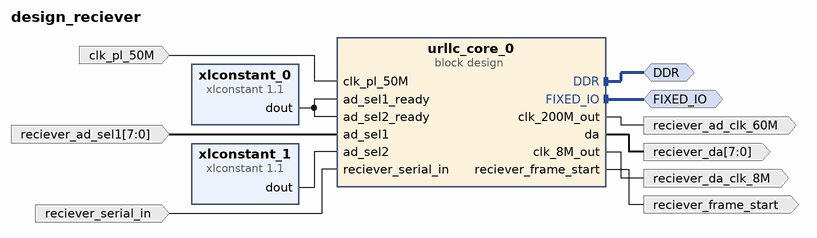
[diagram p0: block diagram of the top level]
# Vivado block design design_reciever, xc7z020clg400-2, Vivado 2021.1
create_bd_design design_reciever

create_bd_intf_port -mode Master -vlnv xilinx.com:interface:ddrx_rtl:1.0 DDR
create_bd_intf_port -mode Master -vlnv xilinx.com:display_processing_system7:fixedio_rtl:1.0 FIXED_IO
create_bd_port -dir I -from 7 -to 0 -type data reciever_ad_sel1
create_bd_port -dir O -type clk reciever_ad_clk_60M
set_property -dict {CONFIG.FREQ_HZ 60000000} [get_bd_ports reciever_ad_clk_60M]
create_bd_port -dir O -type clk reciever_da_clk_8M
create_bd_port -dir O -from 7 -to 0 -type data reciever_da
create_bd_port -dir I -type clk clk_pl_50M
set_property -dict {CONFIG.FREQ_HZ 50000000} [get_bd_ports clk_pl_50M]
create_bd_port -dir I -type intr reciever_serial_in
set_property -dict {CONFIG.SENSITIVITY EDGE_RISING} [get_bd_ports reciever_serial_in]
create_bd_port -dir O -type intr reciever_frame_start

create_bd_cell -type container -reference urllc_core urllc_core_0
set_property -dict [list \
  CONFIG.ACTIVE_SIM_BD urllc_core.bd \
  CONFIG.ACTIVE_SYNTH_BD urllc_core.bd \
  CONFIG.ENABLE_DFX 0 \
  CONFIG.LIST_SIM_BD urllc_core.bd \
  CONFIG.LIST_SYNTH_BD urllc_core.bd \
  CONFIG.LOCK_PROPAGATE 0 \
] [get_bd_cells urllc_core_0]
create_bd_cell -type ip -vlnv xilinx.com:ip:xlconstant:1.1 xlconstant_0
set_property -dict {CONFIG.CONST_VAL 0} [get_bd_cells xlconstant_0]
create_bd_cell -type ip -vlnv xilinx.com:ip:xlconstant:1.1 xlconstant_1
set_property -dict {CONFIG.CONST_VAL 0 CONFIG.CONST_WIDTH 8} [get_bd_cells xlconstant_1]

# ---- connections ----

connect_bd_intf_net [get_bd_intf_ports DDR] [get_bd_intf_pins urllc_core_0/DDR]
connect_bd_intf_net [get_bd_intf_ports FIXED_IO] [get_bd_intf_pins urllc_core_0/FIXED_IO]
connect_bd_net [get_bd_ports clk_pl_50M] [get_bd_pins urllc_core_0/clk_pl_50M]
connect_bd_net -net reciever_ad_sel1_1 [get_bd_ports reciever_ad_sel1] [get_bd_pins urllc_core_0/ad_sel1]
connect_bd_net [get_bd_ports reciever_serial_in] [get_bd_pins urllc_core_0/reciever_serial_in]
connect_bd_net [get_bd_pins urllc_core_0/clk_200M_out] [get_bd_ports reciever_ad_clk_60M]
connect_bd_net [get_bd_pins urllc_core_0/clk_8M_out] [get_bd_ports reciever_da_clk_8M]
connect_bd_net [get_bd_pins urllc_core_0/da] [get_bd_ports reciever_da]
connect_bd_net [get_bd_pins urllc_core_0/reciever_frame_start] [get_bd_ports reciever_frame_start]
connect_bd_net [get_bd_pins xlconstant_0/dout] [get_bd_pins urllc_core_0/ad_sel1_ready] [get_bd_pins urllc_core_0/ad_sel2_ready]
connect_bd_net [get_bd_pins xlconstant_1/dout] [get_bd_pins urllc_core_0/ad_sel2]

# ---- address map ----
assign_bd_address -offset 0x00000000 -range 512M -target_address_space [get_bd_addr_spaces urllc_core_0/data_area/reciever/axi_dma_1/Data_MM2S] [get_bd_addr_segs urllc_core_0/processing_system7_0/S_AXI_HP0/HP0_DDR_LOWOCM]
exclude_bd_addr_seg -offset 0x40400000 -range 64K -target_address_space [get_bd_addr_spaces urllc_core_0/data_area/reciever/axi_dma_1/Data_MM2S] [get_bd_addr_segs urllc_core_0/data_area/reciever/axi_dma_1/S_AXI_LITE/Reg]
exclude_bd_addr_seg -offset 0x40410000 -range 64K -target_address_space [get_bd_addr_spaces urllc_core_0/data_area/reciever/axi_dma_1/Data_MM2S] [get_bd_addr_segs urllc_core_0/data_area/sender/axi_dma_0/S_AXI_LITE/Reg]
assign_bd_address -offset 0x00000000 -range 512M -target_address_space [get_bd_addr_spaces urllc_core_0/data_area/reciever/axi_dma_1/Data_S2MM] [get_bd_addr_segs urllc_core_0/processing_system7_0/S_AXI_HP0/HP0_DDR_LOWOCM]
exclude_bd_addr_seg -offset 0x40400000 -range 64K -target_address_space [get_bd_addr_spaces urllc_core_0/data_area/reciever/axi_dma_1/Data_S2MM] [get_bd_addr_segs urllc_core_0/data_area/reciever/axi_dma_1/S_AXI_LITE/Reg]
exclude_bd_addr_seg -offset 0x40410000 -range 64K -target_address_space [get_bd_addr_spaces urllc_core_0/data_area/reciever/axi_dma_1/Data_S2MM] [get_bd_addr_segs urllc_core_0/data_area/sender/axi_dma_0/S_AXI_LITE/Reg]
assign_bd_address -offset 0x00000000 -range 512M -target_address_space [get_bd_addr_spaces urllc_core_0/data_area/sender/axi_dma_0/Data_MM2S] [get_bd_addr_segs urllc_core_0/processing_system7_0/S_AXI_HP0/HP0_DDR_LOWOCM]
exclude_bd_addr_seg -offset 0x40400000 -range 64K -target_address_space [get_bd_addr_spaces urllc_core_0/data_area/sender/axi_dma_0/Data_MM2S] [get_bd_addr_segs urllc_core_0/data_area/reciever/axi_dma_1/S_AXI_LITE/Reg]
exclude_bd_addr_seg -offset 0x40410000 -range 64K -target_address_space [get_bd_addr_spaces urllc_core_0/data_area/sender/axi_dma_0/Data_MM2S] [get_bd_addr_segs urllc_core_0/data_area/sender/axi_dma_0/S_AXI_LITE/Reg]
assign_bd_address -offset 0x00000000 -range 512M -target_address_space [get_bd_addr_spaces urllc_core_0/data_area/sender/axi_dma_0/Data_S2MM] [get_bd_addr_segs urllc_core_0/processing_system7_0/S_AXI_HP0/HP0_DDR_LOWOCM]
exclude_bd_addr_seg -offset 0x40400000 -range 64K -target_address_space [get_bd_addr_spaces urllc_core_0/data_area/sender/axi_dma_0/Data_S2MM] [get_bd_addr_segs urllc_core_0/data_area/reciever/axi_dma_1/S_AXI_LITE/Reg]
exclude_bd_addr_seg -offset 0x40410000 -range 64K -target_address_space [get_bd_addr_spaces urllc_core_0/data_area/sender/axi_dma_0/Data_S2MM] [get_bd_addr_segs urllc_core_0/data_area/sender/axi_dma_0/S_AXI_LITE/Reg]
assign_bd_address -offset 0x40400000 -range 64K -target_address_space [get_bd_addr_spaces urllc_core_0/processing_system7_0/Data] [get_bd_addr_segs urllc_core_0/data_area/reciever/axi_dma_1/S_AXI_LITE/Reg]
assign_bd_address -offset 0x40410000 -range 64K -target_address_space [get_bd_addr_spaces urllc_core_0/processing_system7_0/Data] [get_bd_addr_segs urllc_core_0/data_area/sender/axi_dma_0/S_AXI_LITE/Reg]
assign_bd_address -offset 0x81200000 -range 64K -target_address_space [get_bd_addr_spaces urllc_core_0/processing_system7_0/Data] [get_bd_addr_segs urllc_core_0/debug_ports/axi_gpio_0/S_AXI/Reg]
assign_bd_address -offset 0x81210000 -range 64K -target_address_space [get_bd_addr_spaces urllc_core_0/processing_system7_0/Data] [get_bd_addr_segs urllc_core_0/debug_ports/axi_gpio_1/S_AXI/Reg]
assign_bd_address -offset 0x83C00000 -range 64K -target_address_space [get_bd_addr_spaces urllc_core_0/processing_system7_0/Data] [get_bd_addr_segs urllc_core_0/multi_clock/clk_wiz_dynamic/s_axi_lite/Reg]
exclude_bd_addr_seg -offset 0x00000000 -range 1 -target_address_space [get_bd_addr_spaces urllc_core_0/processing_system7_0/Data] [get_bd_addr_segs urllc_core_0/processing_system7_0/S_AXI_HP0/HP0_DDR_LOWOCM]
exclude_bd_addr_seg -offset 0x00000000 -range 1 -target_address_space [get_bd_addr_spaces urllc_core_0/processing_system7_0/Data] [get_bd_addr_segs urllc_core_0/processing_system7_0/S_AXI_HP1/HP1_DDR_LOWOCM]

validate_bd_design
save_bd_design
